# EAGLE design mainboard.v2 (EAGLE 6.4)
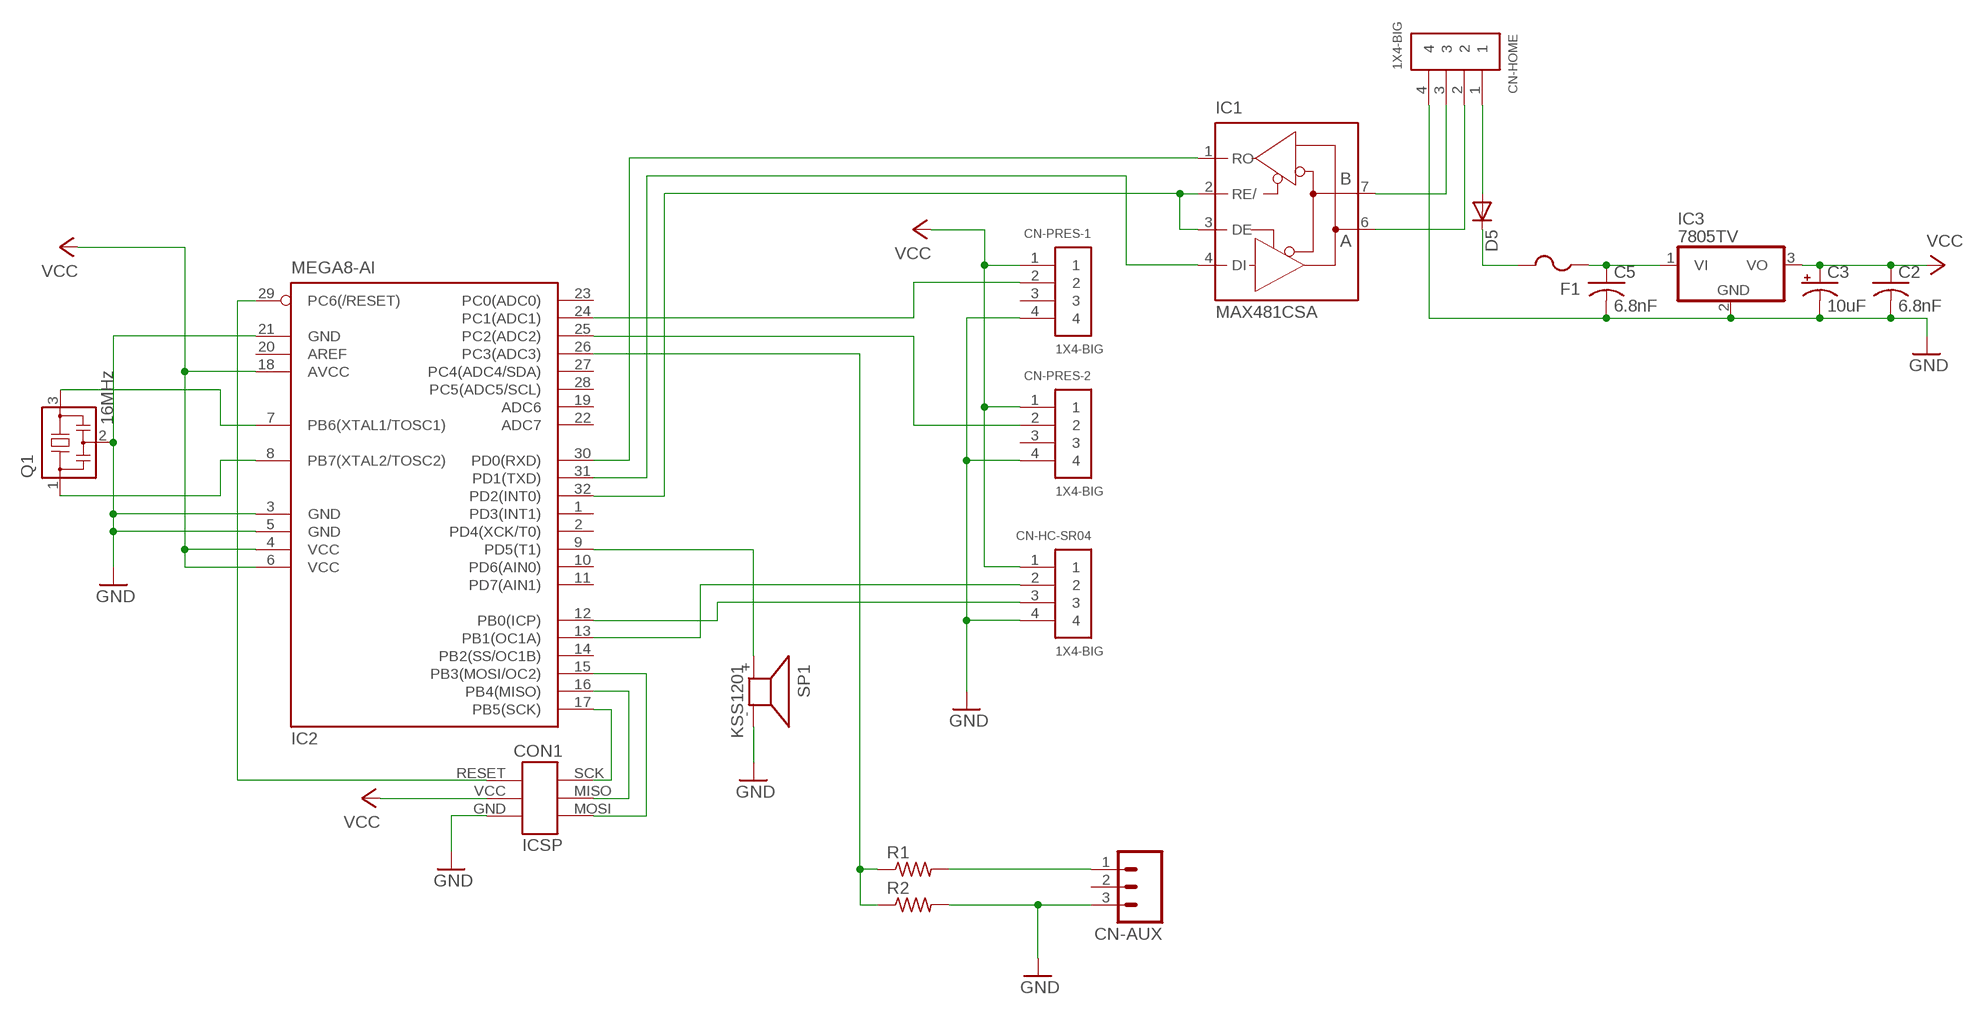
[diagram p0: schematic, sheet 1]

## Parts
C2  6.8nF  C-US050-024X044  [C050-024X044]
C3  10uF  CPOL-USE1.8-4  [E1,8-4]
C5  6.8nF  C-US050-024X044  [C050-024X044]
CN-AUX  M03  [03P]
CN-HC-SR04  1X4-BIG  [1X04-BIG]
CN-HOME  1X4-BIG  [1X04-BIG]
CN-PRES-1  1X4-BIG  [1X04-BIG]
CN-PRES-2  1X4-BIG  [1X04-BIG]
CON1  ICSP-HEADER  [ICSP-HEADER]
D5  DIODE-MICROMELF-W  [MICROMELF-W]
F1  PTCFUSE-1206  [R1206]
IC1  MAX481CSA  [SO08]
IC2  MEGA8-AI  [TQFP32-08]
IC3  7805TV  [TO220V]
Q1  16MHz  RESONATOR  [RESONATOR]
R1  R-US_R0603  [R0603]
R2  R-US_R0603  [R0603]
SP1  KSS1201  [KSS1201]

## Nets
GND: C2.2 C3.- C5.2 CN-AUX.3 CN-HC-SR04.4 CN-HOME.4 CN-PRES-1.4 CN-PRES-2.4 CON1.GND IC2.3(GND) IC2.5(GND) IC2.21(GND) IC3.2(GND) Q1.2 R2.2 SP1.-
N$1: IC2.7(PB6(XTAL1/TOSC1)) Q1.3
N$2: IC2.8(PB7(XTAL2/TOSC2)) Q1.1
N$3: CON1.SCK IC2.17(PB5(SCK))
N$4: CON1.MISO IC2.16(PB4(MISO))
N$5: CON1.MOSI IC2.15(PB3(MOSI/OC2))
N$6: CON1.RESET IC2.29(PC6(/RESET))
N$7: CN-PRES-2.2 IC2.25(PC2(ADC2))
N$8: C5.1 F1.1 IC3.1(VI)
N$9: CN-HOME.1 D5.A
N$10: D5.C F1.2
N$11: CN-AUX.1 R1.2
N$12: IC2.26(PC3(ADC3)) R1.1 R2.1
N$13: IC2.9(PD5(T1)) SP1.+
N$17: CN-PRES-1.2 IC2.24(PC1(ADC1))
N$18: CN-HC-SR04.2 IC2.13(PB1(OC1A))
N$19: CN-HC-SR04.3 IC2.12(PB0(ICP))
N$20: CN-HOME.3 IC1.7(B)
N$22: IC1.2(RE/) IC1.3(DE) IC2.32(PD2(INT0))
N$23: IC1.1(RO) IC2.30(PD0(RXD))
N$24: IC1.4(DI) IC2.31(PD1(TXD))
N$26: CN-HOME.2 IC1.6(A)
VCC: C2.1 C3.+ CN-HC-SR04.1 CN-PRES-1.1 CN-PRES-2.1 CON1.VCC(+5V) IC2.4(VCC) IC2.6(VCC) IC2.18(AVCC) IC3.3(VO)
Unconnected: CN-AUX.2 CN-PRES-1.3 CN-PRES-2.3 IC2.1(PD3(INT1)) IC2.2(PD4(XCK/T0)) IC2.10(PD6(AIN0)) IC2.11(PD7(AIN1)) IC2.14(PB2(SS/OC1B)) IC2.19(ADC6) IC2.20(AREF) IC2.22(ADC7) IC2.23(PC0(ADC0)) IC2.27(PC4(ADC4/SDA)) IC2.28(PC5(ADC5/SCL))

## Power pins joined to a net without a drawn wire
GND: IC1.5(GND)
VCC: IC1.8(VCC)

## Library data of the parts
C2 C5 = adafruit:C-US: CAPACITOR, American symbol
C3 = adafruit:CPOL-US: POLARIZED CAPACITOR, American symbol
CN-AUX = con-amp-quick:M03: AMP QUICK CONNECTOR; OC_FARNELL: unknown; OC_NEWARK: unknown
CN-HC-SR04 CN-HOME CN-PRES-1 CN-PRES-2 = adafruit:1X4: 4-pin connector
CON1 = serge:ICSP-HEADER
D5 = diode:DIODE-: DIODE
F1 = adafruit:PTCFUSE: PTC fuses, resettable thermistors
IC1 = maxim:MAX481CSA: RS485 TRANSEIVER; MF: MAXIM; MPN: MAX481CSA; OC_FARNELL: unknown; OC_NEWARK: 90C3817
IC2 = atmel:MEGA8: MICROCONTROLLER 8 Kbytes FLASH, 1 kbytes SRAM, 512 bytes EEPROM, USART, 6-channel 10 bit ADC, 2-channel 8 bit ADC Pin compatible with Atmega48, ATMega88, ATMega168 Source: avr.lbr; MPN: ATMEGA8-16AU; OC_FARNELL: 9171371; OC_NEWARK: 73M8863
IC3 = linear:78*: Positive VOLTAGE REGULATOR Source: http://cache.national.com/ds/LM/LM78L05.pdf http://www.fairchildsemi.com/ds/LM/LM7805.pdf
Q1 = serge:RESONATOR
R1 R2 = adafruit:R-US_: RESISTOR, American symbol
SP1 = buzzer:KSS1201: SPEAKER Source: Schukat; OC_FARNELL: unknown; OC_NEWARK: unknown

## Board
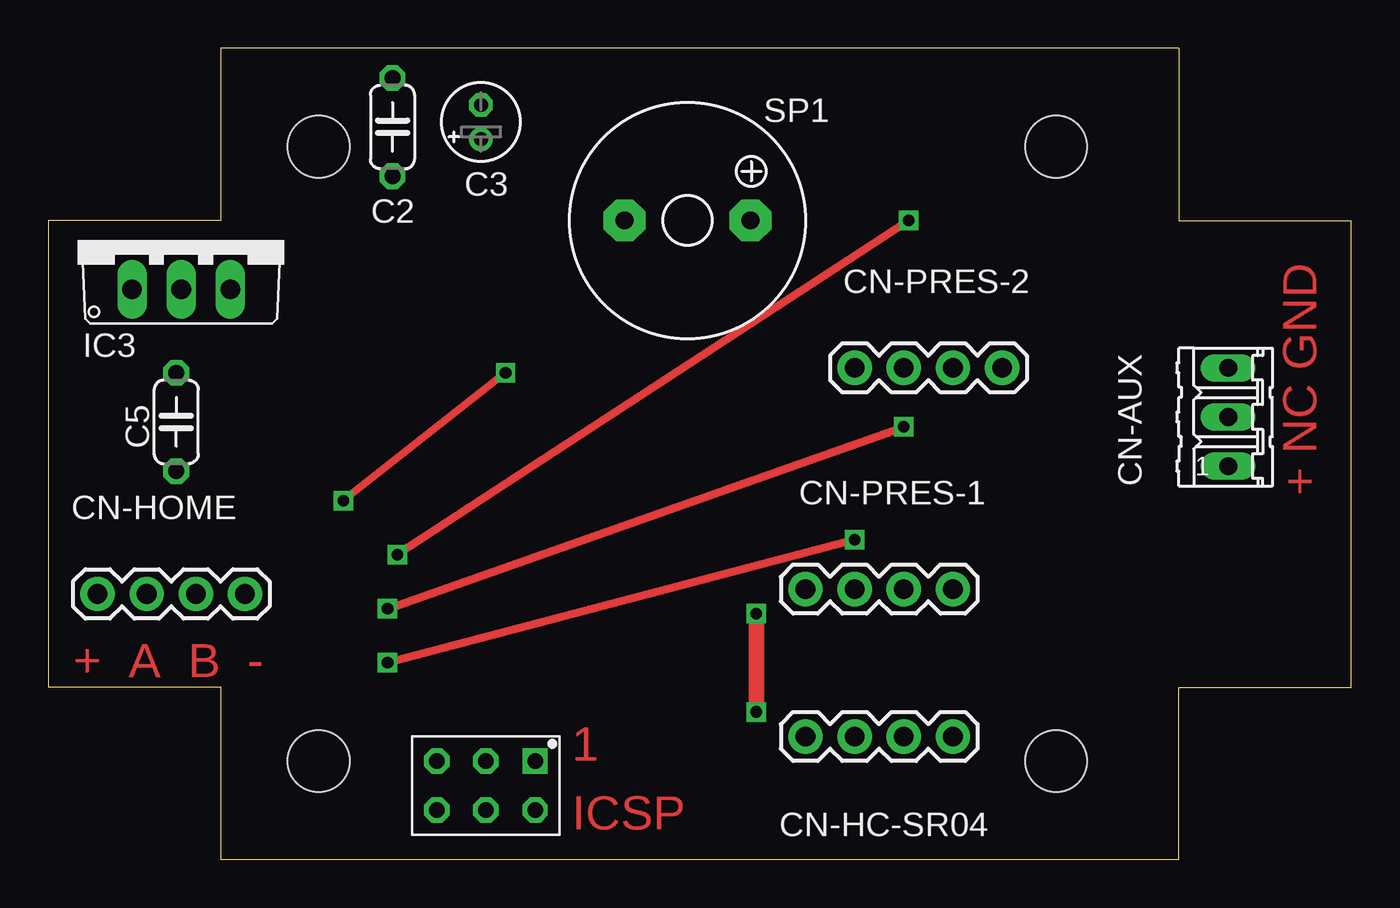
[diagram p1: board, top side]
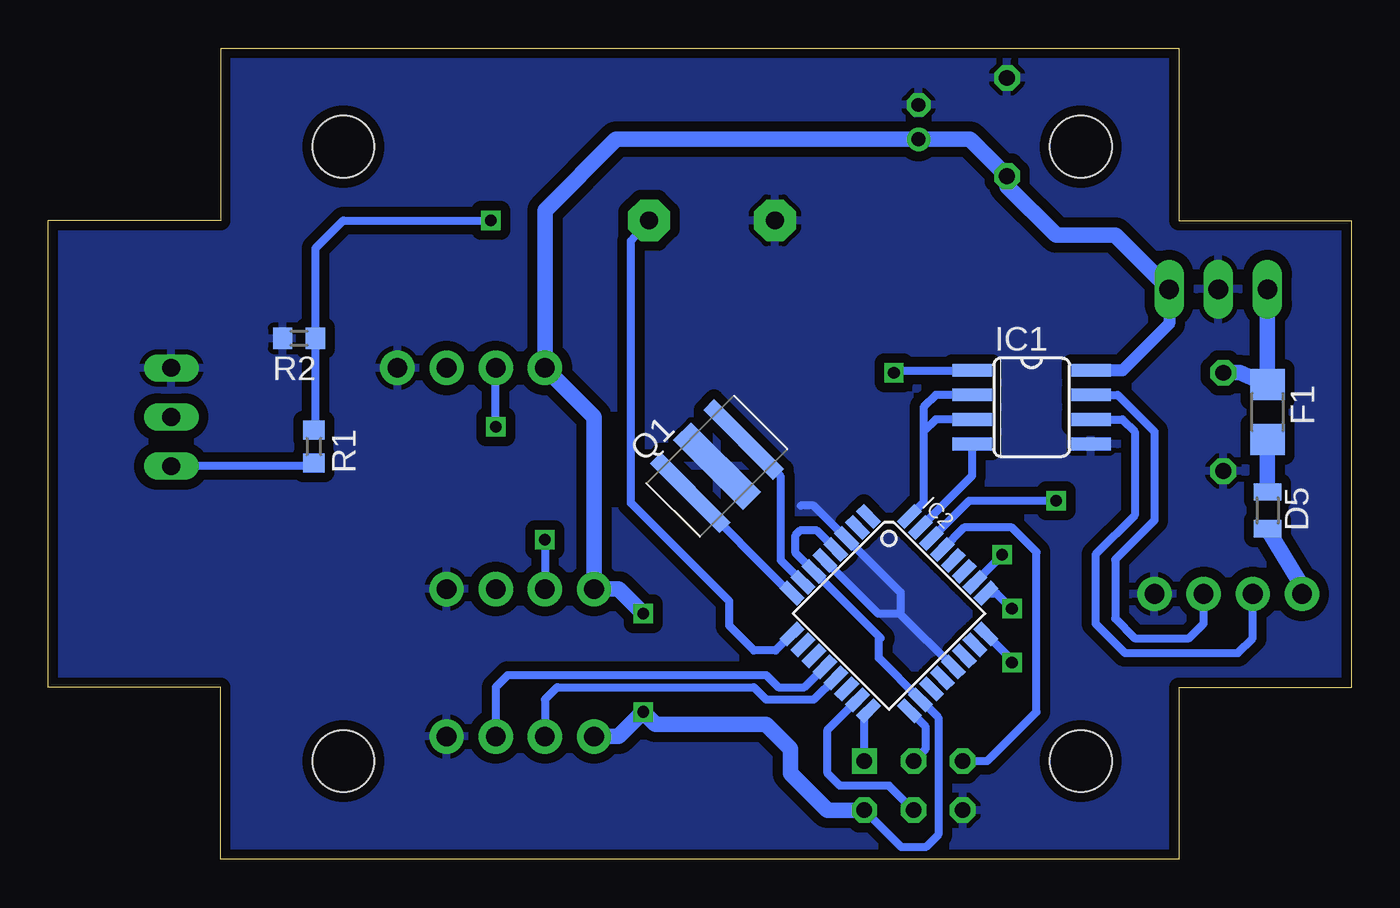
[diagram p2: board, bottom side, seen from below]

Size 67.31 x 41.91 mm. Coordinates in mm from the lower left corner, seen from the top.
Outline: 8.89,0 58.42,0 58.42,8.89 67.31,8.89 67.31,33.02 58.42,33.02 58.42,41.91 8.89,41.91 8.89,33.02 0,33.02 0,8.89 8.89,8.89 8.89,0
Copper layers (1*16): Top 0.035mm / dielectric 1.5mm / Bottom 0.035mm
Design rules "default *": minimum track width 10mil, minimum drill 24mil, track to track 20mil, track to pad 20mil, pad to pad 20mil, via to via 20mil, smd to smd 20mil, copper to edge 20mil, drill to drill 8mil, minimum pad ring 10mil, minimum via ring 8mil, stop-mask expansion 4mil, vias tented up to drill 0mil, thermal gap 10mil
Holes 3.2 mm at 13.97,5.08 13.97,36.83 52.07,36.83 52.07,5.08

### Footprints (pad centres in the part's own frame; a part is rotated, then mirrored left to right if it is on the bottom)
C050-024X044 = drill 0.813 octagon: 1 -2.54,0; 2 2.54,0
E1,8-4 = drill 0.711 pad 1.168: + -0.889,0 | drill 0.711 pad 1.168 octagon: - 0.889,0
03P = drill 0.914 long: 1 -2.54,0; 2 0,0; 3 2.54,0
1X04-BIG = drill 1.016 pad 1.778: 1 0,0; 2 2.54,0; 3 5.08,0; 4 7.62,0
ICSP-HEADER = drill 0.8 octagon: GND 1.27,-3.81; MOSI 1.27,-1.27; RESET -1.27,-3.81; SCK -1.27,-1.27; VCC 1.27,1.27 | drill 0.8 square: MISO -1.27,1.27
MICROMELF-W = smd 0.9 x 1.4: A 0.95,0; C -0.95,0
R1206 = smd 1.6 x 1.803: 1 -1.422,0; 2 1.422,0
SO08 = smd 0.66 x 2.032: 1 -1.905,-3.073; 2 -0.635,-3.073; 3 0.635,-3.073; 4 1.905,-3.073; 5 1.905,3.073; 6 0.635,3.073; 7 -0.635,3.073; 8 -1.905,3.073
TQFP32-08 = smd 1.27 x 0.559: 1 -4.293,2.8; 2 -4.293,2; 3 -4.293,1.2; 4 -4.293,0.4; 5 -4.293,-0.4; 6 -4.293,-1.2; 7 -4.293,-2; 8 -4.293,-2.8; 17 4.293,-2.8; 18 4.293,-2; 19 4.293,-1.2; 20 4.293,-0.4; 21 4.293,0.4; 22 4.293,1.2; 23 4.293,2; 24 4.293,2.8 | smd 0.559 x 1.27: 9 -2.8,-4.293; 10 -2,-4.293; 11 -1.2,-4.293; 12 -0.4,-4.293; 13 0.4,-4.293; 14 1.2,-4.293; 15 2,-4.293; 16 2.8,-4.293; 25 2.8,4.293; 26 2,4.293; 27 1.2,4.293; 28 0.4,4.293; 29 -0.4,4.293; 30 -1.2,4.293; 31 -2,4.293; 32 -2.8,4.293
TO220V = drill 1.016 long: 1 -2.54,-2.54; 2 0,-2.54; 3 2.54,-2.54
RESONATOR = smd 0.8 x 5.1: 1 -1.95,0; 3 1.95,0 | smd 1.3 x 5.1: 2 0,0
R0603 = smd 1 x 1.1: 1 -0.85,0; 2 0.85,0
KSS1201 = drill 0.914 pad 2.159 octagon: + 3.251,0; - -3.251,0

### Placement (x,y rotation side)
C2  17.78,37.85 90 top
C3  22.35,38.1 90 top
C5  6.6,22.61 270 top
CN-AUX  60.96,22.86 90 top
CN-HC-SR04  39.12,6.35 0 top
CN-HOME  2.54,13.72 0 top
CN-PRES-1  39.12,13.97 0 top
CN-PRES-2  41.66,25.4 0 top
CON1  23.88,3.81 270 top
D5  4.32,18.03 270 bottom
F1  4.32,23.11 270 bottom
IC1  16.51,23.37 270 bottom
IC2  23.88,12.7 315 bottom
IC3  6.86,32 0 top
Q1  32.77,20.32 45 bottom
R1  53.59,21.34 270 bottom
R2  54.36,26.92 180 bottom
SP1  33.02,33.02 0 top

### Tracks (layer width: path | path; a pad name or v marks a point on that pad's centre or on a via)
GND
  Bottom 0.406: IC2.5 24.44,12.7 23.31,12.7 23.28,12.66 | 23.28,12.66 IC2.21 | 23.28,12.66 23.28,13.8 IC2.3 27.77,18.29 28.45,18.29
  pour Bottom: 0,42.67 0,0 69.09,0 69.09,42.67
N$1
  Bottom 0.406: IC2.7 29.46,15.46 29.46,19.78 Q1.3
N$2
  Bottom 0.406: IC2.8 28.96,13.76 Q1.1
N$3
  Bottom 0.406: CON1.SCK 21.97,5.71 21.97,6.83 IC2.17
N$4
  Bottom 0.406: CON1.MISO 25.15,7.47 IC2.16
N$5
  Bottom 0.406: CON1.MOSI 23.88,3.81 26.42,3.81 27.05,4.45 27.05,6.7 IC2.15
N$6
  Bottom 0.406: CON1.RESET 18.8,5.08 16.26,7.62 16.26,15.88 17.53,17.14 20,17.14 IC2.29
N$7  (via drill 0.6)
  Top 0.406: v17.53,12.95 v44.2,22.35
  Bottom 0.406: IC2.25 18.33,13.76 v17.53,12.95 | v44.2,22.35 CN-PRES-2.2
N$8
  Bottom 0.813: IC3.1 F1.1 5.74,25.15 C5.1
N$9
  Bottom 0.813: CN-HOME.1 2.29,13.72 D5.A
N$10
  Bottom 0.813: D5.C F1.2
N$11
  Bottom 0.406: R1.2 53.76,20.32 CN-AUX.1
N$12  (via drill 0.6)
  Top 0.406: v44.45,33.02 v18.03,15.75
  Bottom 0.406: v44.45,33.02 52.07,33.02 53.51,31.58 R2.1 53.51,22.27 R1.1 | v18.03,15.75 18.03,15.71 IC2.26
N$13
  Bottom 0.406: IC2.9 29.74,10.79 30.86,10.79 32.13,12.06 32.13,13.34 37.21,18.41 37.21,31.95 SP1.+
N$17  (via drill 0.6)
  Top 0.406: v41.66,16.51 v17.53,10.16
  Bottom 0.406: v17.53,10.16 17.53,10.31 IC2.24 | v41.66,16.51 CN-PRES-1.2
N$18
  Bottom 0.406: IC2.13 27.75,8.26 30.23,8.26 30.86,8.89 41.02,8.89 41.66,8.26 CN-HC-SR04.2
N$19
  Bottom 0.406: IC2.12 28.25,8.89 29.59,8.89 30.23,9.53 43.56,9.53 44.2,8.89 CN-HC-SR04.3
N$20
  Bottom 0.406: IC1.7 12.06,24 10.16,22.1 10.16,17.53 12.19,15.49 12.19,12.45 11.18,11.43 8.38,11.43 7.62,12.19 CN-HOME.3
N$22
  Bottom 0.406: IC1.2 21.46,24 22.1,23.37 22.1,22.1 | 22.1,22.1 22.1,18.44 IC2.32 | IC1.3 21.46,22.73 22.1,22.1
N$23  (via drill 0.6)
  Top 0.406: v15.24,18.54 v23.62,25.15
  Bottom 0.406: IC2.30 19.73,18.54 v15.24,18.54 | v23.62,25.15 23.5,25.27 IC1.1
N$24
  Bottom 0.406: IC1.4 19.58,19.82 IC2.31
N$26
  Bottom 0.406: IC1.6 11.81,22.73 11.18,22.1 11.18,17.78 13.21,15.75 13.21,12.19 11.68,10.67 5.84,10.67 5.08,11.43 CN-HOME.2
VCC  (via drill 0.6)
  Top 0.813: v36.58,7.62 v36.58,12.7
  Bottom 0.406: 24.3,11.43 24.41,11.53 | 24.41,11.53 IC2.6 28.7,15.83 28.7,16.76 28.45,17.02 27.63,17.02 IC2.4 | 24.41,11.53 24.41,10.4 IC2.18 21.34,7.33 21.34,1.27 21.97,0.64 23.24,0.64 CON1.VCC
  Bottom 0.61: IC3.3 9.4,27.69 11.81,25.27 IC1.8
  Bottom 0.813: CN-HC-SR04.1 37.85,6.35 v36.58,7.62 35.94,6.99 30.23,6.99 28.96,5.71 28.96,4.45 27.05,2.54 CON1.VCC | v36.58,12.7 37.85,13.97 CN-PRES-1.1 39.12,22.86 CN-PRES-2.1 41.66,33.53 37.97,37.21 C3.+ 19.68,37.21 C2.1 17.78,34.8 15.24,32.26 12.19,32.26 IC3.3

### Text on the board
Top: + NC GND | + A B - | 1 | ICSP